# EAGLE design rk8-05 (EAGLE 6.6.0)
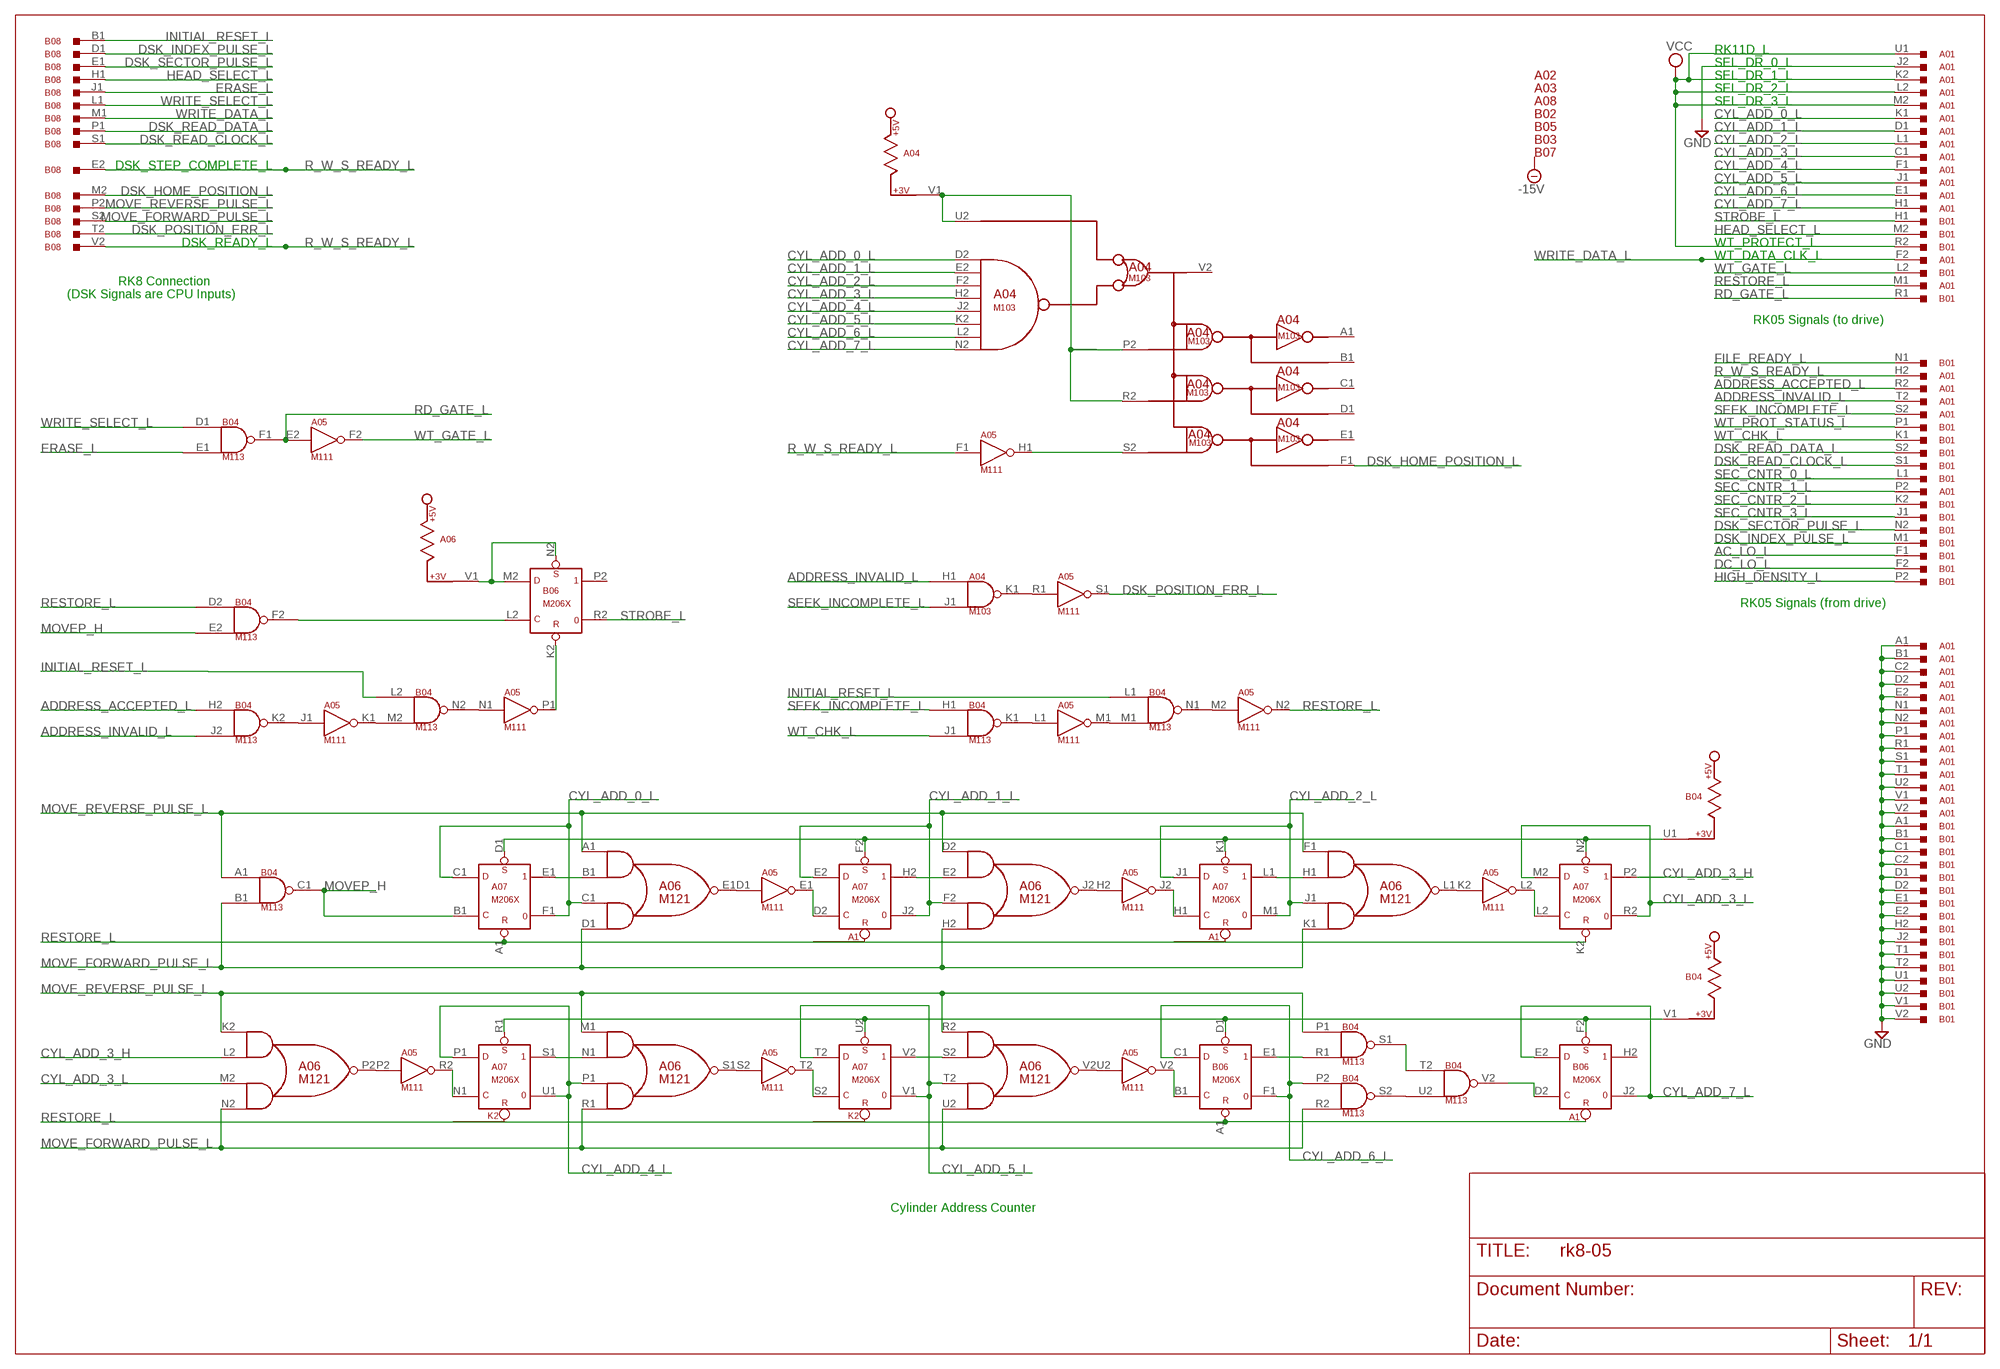
[diagram p0: schematic, sheet 1]

## Parts
A01  M916  [H807]
A02  EMPTY  [H807]
A03  EMPTY  [H807]
A04  M103  [H807]
A05  M111  [H807]
A06  M121  [H807]
A07  M206X  [H807]
A08  EMPTY  [H807]
B01  M916  [H807]
B02  EMPTY  [H807]
B03  EMPTY  [H807]
B04  M113  [H807]
B05  EMPTY  [H807]
B06  M206X  [H807]
B07  EMPTY  [H807]
B08  M903  [H807]

## Nets
AC_LO_L: B01.F1
ADDRESS_ACCEPTED_L: A01.R2 B04.H2(K2:IN1)
ADDRESS_INVALID_L: A01.T2 A04.H1(K1:IN1) B04.J2(K2:IN2)
CYL_ADD_0_L: A01.K1 A04.D2(V2:D2) A06.C1(E1:IN2A) A07.C1(E1:D) A07.F1
CYL_ADD_1_L: A01.D1 A04.E2(V2:E2) A06.F2(J2:IN2A) A07.E2(H2:D) A07.J2
CYL_ADD_2_L: A01.L1 A04.F2(V2:F2) A06.J1(L1:IN2A) A07.J1(L1:D) A07.M1
CYL_ADD_3_H: A06.L2(P2:IN1B) A07.P2
CYL_ADD_3_L: A01.C1 A04.H2(V2:H2) A06.M2(P2:IN2A) A07.M2(P2:D) A07.R2
CYL_ADD_4_L: A01.F1 A04.J2(V2:J2) A06.P1(S1:IN2A) A07.P1(S1:D) A07.U1
CYL_ADD_5_L: A01.J1 A04.K2(V2:K2) A06.T2(V2:IN2A) A07.T2(V2:D) A07.V1
CYL_ADD_6_L: A01.E1 A04.L2(V2:L2) B04.P2(S2:IN1) B06.C1(E1:D) B06.F1
CYL_ADD_7_L: A01.H1 A04.N2(V2:N2) B06.E2(H2:D) B06.J2
DC_LO_L: B01.F2
DSK_HOME_POSITION_L: A04.F1(V2:F1) B08.M2
DSK_INDEX_PULSE_L: B01.M1 B08.D1
DSK_POSITION_ERR_L: A05.S1(S1:OUT) B08.T2
DSK_READ_CLOCK_L: B01.S1 B08.S1
DSK_READ_DATA_L: B01.S2 B08.P1
DSK_SECTOR_PULSE_L: B01.N2 B08.E1
ERASE_L: B04.E1(F1:IN2) B08.J1
FILE_READY_L: B01.N1
GND [power]: A01.A1 A01.B1 A01.C2 A01.D2 A01.E2 A01.J2 A01.N1 A01.N2 A01.P1 A01.R1 A01.S1 A01.T1 A01.U2 A01.V1 A01.V2 B01.A1 B01.B1 B01.C1 B01.C2 B01.D1 B01.D2 B01.E1 B01.E2 B01.H2 B01.J2 B01.T1 B01.T2 B01.U1 B01.U2 B01.V1 B01.V2
HEAD_SELECT_L: B01.M2 B08.H1
HIGH_DENSITY_L: B01.P2
INITIAL_RESET_L: B04.L1(N1:IN1) B04.L2(N2:IN1) B08.B1
MOVE_FORWARD_PULSE_L: A06.D1(E1:IN2B) A06.H2(J2:IN2B) A06.K1(L1:IN2B) A06.N2(P2:IN2B) A06.R1(S1:IN2B) A06.U2(V2:IN2B) B04.B1(C1:IN2) B04.R2(S2:IN2) B08.S2
MOVE_REVERSE_PULSE_L: A06.A1(E1:IN1A) A06.D2(J2:IN1A) A06.F1(L1:IN1A) A06.K2(P2:IN1A) A06.M1(S1:IN1A) A06.R2(V2:IN1A) B04.A1(C1:IN1) B04.P1(S1:IN1) B08.P2
MOVEP_H: A07.B1(E1:C) B04.C1(C1:OUT) B04.E2(F2:IN2)
N$1: A05.P2(R2:IN) A06.P2(P2:OUT)
N$2: A07.D1(E1:S) A07.F2(H2:S) A07.K1(L1:S) A07.N2(P2:S) B04.U1
N$3: A07.R1(S1:S) A07.U2(V2:S) B04.V1 B06.D1(E1:S) B06.F2(H2:S)
N$4: A06.B1(E1:IN1B) A07.E1
N$5: A05.E1(E1:OUT) A07.D2(H2:C)
N$6: A06.E2(J2:IN1B) A07.H2
N$7: A05.J2(J2:OUT) A07.H1(L1:C)
N$8: A05.R2(R2:OUT) A07.N1(S1:C)
N$9: A06.H1(L1:IN1B) A07.L1
N$10: A05.S2(T2:IN) A06.S1(S1:OUT)
N$11: A05.L2(L2:OUT) A07.L2(P2:C)
N$12: A05.T2(T2:OUT) A07.S2(V2:C)
N$13: B04.S2(S2:OUT) B04.U2(V2:IN2)
N$14: B04.S1(S1:OUT) B04.T2(V2:IN1)
N$15: A05.H2(J2:IN) A06.J2(J2:OUT)
N$16: A04.S2(V2:S2) A05.H1(H1:OUT)
N$17: A05.D1(E1:IN) A06.E1(E1:OUT)
N$18: A05.U2(V2:IN) A06.V2(V2:OUT)
N$19: B04.V2(V2:OUT) B06.D2(H2:C)
N$20: B04.R1(S1:IN2) B06.E1
N$21: A05.K2(L2:IN) A06.L1(L1:OUT)
N$22: A06.S2(V2:IN1B) A07.V2
N$23: A06.N1(S1:IN1B) A07.S1
N$24: B04.F2(F2:OUT) B06.L2(P2:C)
N$25: A05.L1(M1:IN) B04.K1(K1:OUT)
N$26: A05.M1(M1:OUT) B04.M1(N1:IN2)
N$27: A06.V1 B06.M2(P2:D) B06.N2(P2:S)
N$28: A04.K1(K1:OUT) A05.R1(S1:IN)
N$29: A05.V2(V2:OUT) B06.B1(E1:C)
N$30: A05.J1(K1:IN) B04.K2(K2:OUT)
N$31: A05.K1(K1:OUT) B04.M2(N2:IN2)
N$32: A05.N1(P1:IN) B04.N2(N2:OUT)
N$33: A05.P1(P1:OUT) B06.K2(P2:R)
N$34: A05.M2(N2:IN) B04.N1(N1:OUT)
N$36: A04.P2(V2:P2) A04.R2(V2:R2) A04.U2(V2:U2) A04.V1
R_W_S_READY_L: A01.H2 A05.F1(H1:IN) B08.E2 B08.V2
RD_GATE_L: A05.E2(F2:IN) B01.R1 B04.F1(F1:OUT)
RESTORE_L: A01.M1 A05.N2(N2:OUT) A07.A1(E1:R) A07.K2(P2:R) B04.D2(F2:IN1) B06.A1(E1:R)
SEC_CNTR_0_L: B01.L1
SEC_CNTR_1_L: A01.P2
SEC_CNTR_2_L: B01.K2
SEC_CNTR_3_L: B01.J1
SEEK_INCOMPLETE_L: A01.S2 A04.J1(K1:IN2) B04.H1(K1:IN1)
STROBE_L: B01.H1 B06.R2
VCC: A01.K2 A01.L2 A01.M2 A01.U1 B01.R2
WRITE_DATA_L: A01.F2 B08.M1
WRITE_SELECT_L: B04.D1(F1:IN1) B08.L1
WT_CHK_L: B01.K1 B04.J1(K1:IN2)
WT_GATE_L: A05.F2(F2:OUT) B01.L2
WT_PROT_STATUS_L: B01.P1
Unconnected: A01.A2 A01.B2 A04.A1(V2:A1) A04.B1(V2:B1) A04.C1(V2:C1) A04.D1(V2:D1) A04.E1(V2:E1) A04.L1(N1:IN1) A04.M1(N1:IN2) A04.N1(N1:OUT) A04.V2(V2:V2) A05.A1(B1:IN) A05.B1(B1:OUT) A05.C1(D2:IN) A05.D2(D2:OUT) A05.U1(U1:OUT) A05.V1(U1:IN) A06.U1 B01.A2 B01.B2 B06.H1(L1:C) B06.H2 B06.J1(L1:D) B06.K1(L1:S) B06.L1 B06.M1 B06.N1(S1:C) B06.P1(S1:D) B06.P2 B06.R1(S1:S) B06.S1 B06.S2(V2:C) B06.T2(V2:D) B06.U1 B06.U2(V2:S) B06.V1 B06.V2 B08.D2 B08.H2 B08.K2

## Notes on the sheet
- RK11D_L
- SEL_DR_0_L
- SEL_DR_1_L
- SEL_DR_2_L
- SEL_DR_3_L
- DSK_STEP_COMPLETE_L
- DSK_READY_L | WT_PROTECT_L
- WT_DATA_CLK_L
- RK8 Connection
- (DSK Signals are CPU Inputs)
- RK05 Signals (to drive)
- RK05 Signals (from drive)
- Cylinder Address Counter

## Power pins joined to a net without a drawn wire
-15V: A02.B2 A03.B2 A08.B2 B02.B2 B03.B2 B05.B2 B07.B2
GND: A02.C2 A03.C2 A04.C2(GND) A04.T1(GND) A05.C2(GND) A05.T1(GND) A06.C2(GND) A06.T1(GND) A07.C2(GND) A07.T1(GND) A08.C2 B02.C2 B03.C2 B04.C2(GND) B04.T1(GND) B05.C2 B06.C2(GND) B06.T1(GND) B07.C2 B08.A1 B08.C1 B08.C2 B08.F1 B08.F2 B08.J2 B08.K1 B08.L2 B08.N1 B08.N2 B08.R1 B08.R2 B08.T1 B08.U2
VCC: A02.A2 A03.A2 A04.A2(VCC) A05.A2(VCC) A06.A2(VCC) A07.A2(VCC) A08.A2 B02.A2 B03.A2 B04.A2(VCC) B05.A2 B06.A2(VCC) B07.A2

## Library data of the parts
A01 B01 = dec-m:M916: Simple 36 pin connector/wire cable
A02 A03 A08 B02 B03 B05 B07 = dec-m:EMPTY: Empty Slot
A04 = dec-m:M103: M103 Device Selector Used to decode IOT requests.
A05 = dec-m:M111: Sixteen inverters.
A06 = dec-m:M121: 6 2-2 AND-NOR Gates
A07 B06 = dec-m:M206X: Two sets of 3 D flip-flops
B04 = dec-m:M113: 10 2-input NAND Gates
B08 = dec-m:M903: Two-sided Posibus cable/connector.

## Net classes
1 power: width 0.508 mm

## Board
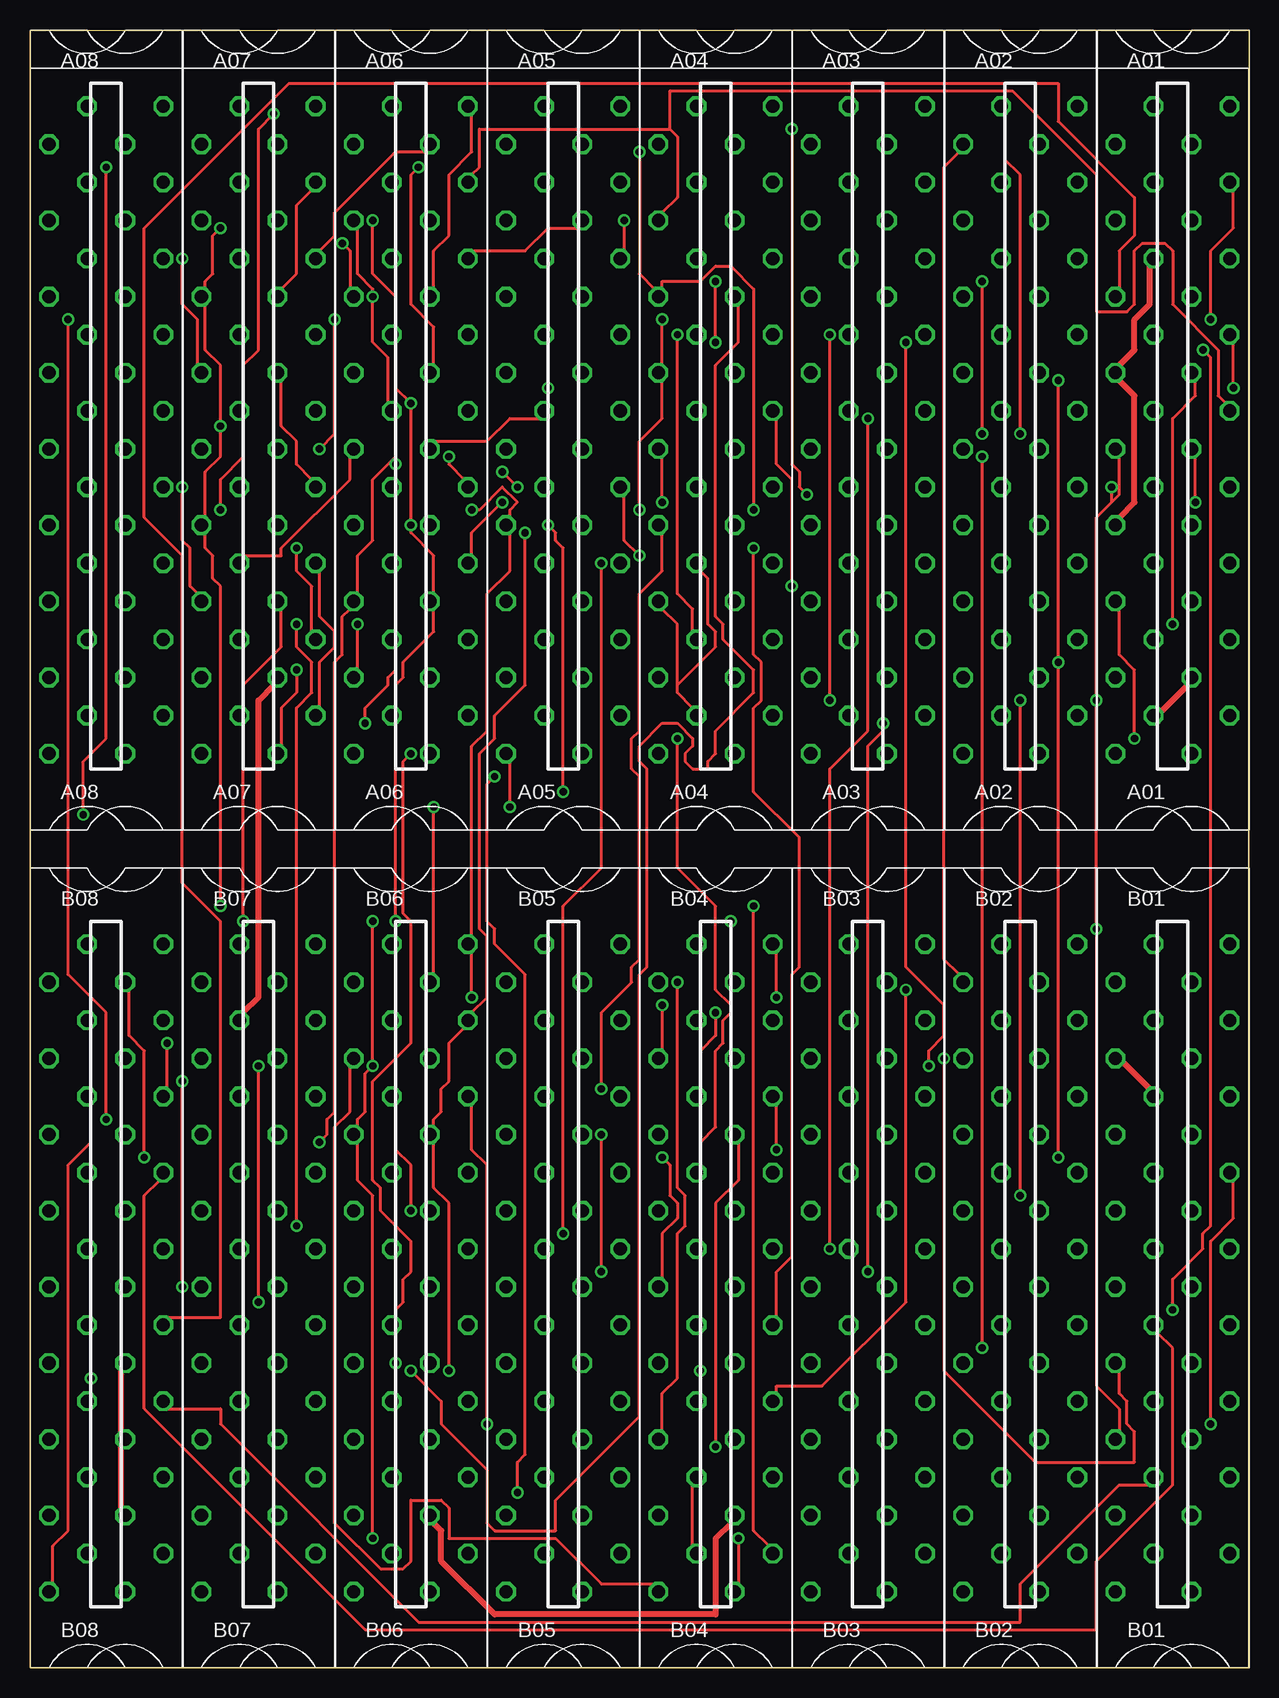
[diagram p1: board, top side]
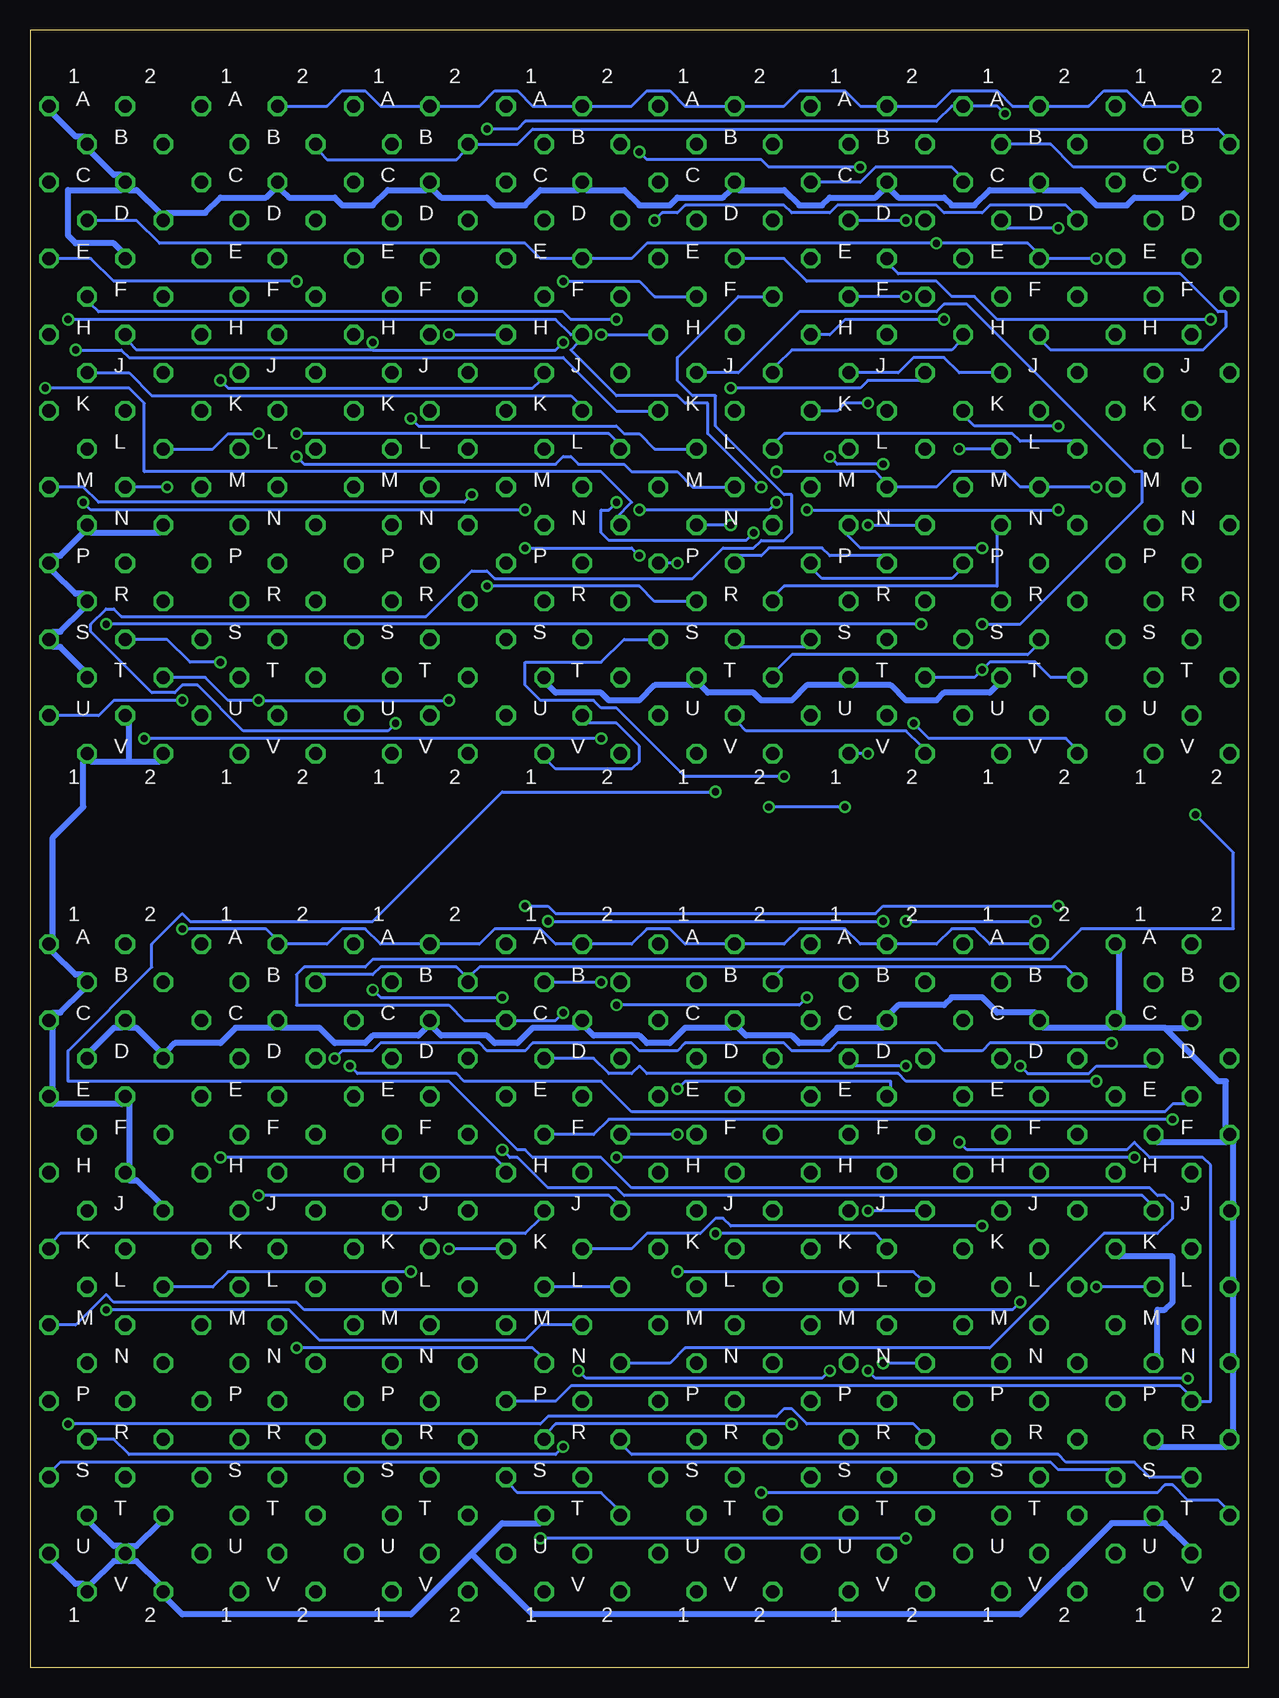
[diagram p2: board, bottom side, seen from below]

Size 101.6 x 136.53 mm. Coordinates in mm from the lower left corner, seen from the top.
Outline: 0,0 101.6,0 101.6,136.53 0,136.53 0,0
Copper layers (1*16): Top 0.035mm / dielectric 1.5mm / Bottom 0.035mm
Design rules "10mils": minimum track width 10mil, minimum drill 24mil, track to track 10mil, track to pad 10mil, pad to pad 10mil, via to via 10mil, smd to smd 10mil, copper to edge 25mil, drill to drill 10mil, minimum pad ring 10mil, minimum via ring 8mil, stop-mask expansion 0mil, vias tented up to drill 0mil, thermal gap 10mil

### Footprints (pad centres in the part's own frame; a part is rotated, then mirrored left to right if it is on the bottom)
H807 = drill 1.092 octagon: A1 4.763,28.575; A2 -1.587,28.575; B1 1.587,25.4; B2 -4.763,25.4; C1 4.763,22.225; C2 -1.587,22.225; D1 1.587,19.05; D2 -4.763,19.05; E1 4.763,15.875; E2 -1.587,15.875; F1 1.587,12.7; F2 -4.763,12.7; H1 4.763,9.525; H2 -1.587,9.525; J1 1.587,6.35; J2 -4.763,6.35; K1 4.763,3.175; K2 -1.587,3.175; L1 1.587,0; L2 -4.763,0; M1 4.763,-3.175; M2 -1.587,-3.175; N1 1.587,-6.35; N2 -4.763,-6.35; P1 4.763,-9.525; P2 -1.587,-9.525; R1 1.587,-12.7; R2 -4.763,-12.7; S1 4.763,-15.875; S2 -1.587,-15.875; T1 1.587,-19.05; T2 -4.763,-19.05; U1 4.763,-22.225; U2 -1.587,-22.225; V1 1.587,-25.4; V2 -4.763,-25.4

### Placement (x,y rotation side)
A01  95.25,101.6 0 top
A02  82.55,101.6 0 top
A03  69.85,101.6 0 top
A04  57.15,101.6 0 top
A05  44.45,101.6 0 top
A06  31.75,101.6 0 top
A07  19.05,101.6 0 top
A08  6.35,101.6 0 top
B01  95.25,31.75 0 top
B02  82.55,31.75 0 top
B03  69.85,31.75 0 top
B04  57.15,31.75 0 top
B05  44.45,31.75 0 top
B06  31.75,31.75 0 top
B07  19.05,31.75 0 top
B08  6.35,31.75 0 top
U$1  [CBLOCK]  0,0 0 top
U$2  [CBLOCK]  50.8,0 0 top

### Tracks (layer width: path | path; a pad name or v marks a point on that pad's centre or on a via)
-15V
  Top 0.254: B02.B2 77.47,57.78 76.2,59.05 76.2,125.09 77.47,126.36 A02.B2
  Bottom 0.254: B02.B2 77.47,57.78 73.03,57.78 72.39,58.42 66.04,58.42 65.41,57.78 B03.B2 64.77,57.78 64.14,58.42 38.73,58.42 | 38.73,58.42 15.24,58.42 14.61,57.78 B07.B2 | 38.73,58.42 39.37,57.78 B05.B2 | A08.B2 1.91,127.64 2.54,128.27 59.69,128.27 60.96,127 64.77,127 A03.B2 65.41,126.36 66.04,125.73 76.83,125.73 77.47,126.36 A02.B2
ADDRESS_ACCEPTED_L  (via drill 0.61)
  Top 0.254: v53.98,77.47 53.98,66.67 57.15,63.5 57.15,56.52 58.42,55.24 58.42,54.61 57.78,53.98 57.78,52.07 57.15,51.44 57.15,45.09 55.88,43.81 55.88,41.91 B04.H2 | v92.08,77.47 92.08,83.19 90.81,84.45 90.81,88.27 A01.R2
  Bottom 0.254: v53.98,77.47 v92.08,77.47
ADDRESS_INVALID_L  (via drill 0.61)
  Top 0.254: v82.55,39.37 v82.55,80.64 | v66.67,80.64 v66.67,111.12
  Bottom 0.254: v82.55,39.37 53.34,39.37 52.7,38.73 B04.J2 | A01.T2 90.17,82.55 87,82.55 85.09,80.64 v82.55,80.64 v66.67,80.64 | v66.67,111.12 62.23,111.12 A04.H1
CYL_ADD_0_L
  Top 0.254: A07.F1 20.95,114.94 22.23,116.2 22.23,121.92 23.5,123.19 A07.C1 | 53.34,128.27 53.98,127.64 53.98,122.56 52.7,121.28 A04.D2 | 53.34,128.27 37.47,128.27 37.47,125.09 36.83,124.46 A06.C1 | 53.34,128.27 53.34,131.44 81.92,131.44 88.9,124.46 88.9,113.03 91.44,113.03 92.08,113.67 92.08,118.11 92.71,118.75 94.61,118.75 95.25,118.11 95.25,113.67 99.06,109.86 99.06,106.05 99.69,105.41 A01.K1
  Bottom 0.254: A06.C1 36.2,123.83 32.38,123.83 31.11,125.09 24.77,125.09 24.13,124.46 A07.C1
CYL_ADD_1_L  (via drill 0.61)
  Top 0.254: v26.04,118.75 26.67,118.11 26.67,114.94 A06.F2 | v12.7,117.47 12.7,113.67 13.97,112.39 13.97,108.58 A07.J2
  Bottom 0.254: v12.7,117.47 17.14,117.47 A07.E2 17.78,118.11 18.41,118.75 v26.04,118.75 50.16,118.75 51.44,117.47 55.24,117.47 A04.E2 55.88,117.47 59.05,117.47 60.33,118.75 90.81,118.75 92.71,120.65 96.52,120.65 A01.D1
CYL_ADD_2_L  (via drill 0.61)
  Top 0.254: A07.M1 23.5,99.06 22.23,100.33 22.23,102.23 20.95,103.5 20.95,107.31 A07.J1 | v50.8,126.36 50.8,116.2 52.07,114.94 A04.F2 52.7,114.94 52.7,115.57 55.88,115.57 57.15,116.84 58.42,116.84 60.33,114.94 v60.33,96.52 | v32.38,125.09 31.75,124.46 31.75,113.67 33.66,111.76 33.66,108.58 A06.J1 | v97.16,97.16 97.16,100.97 A01.L1
  Bottom 0.254: v50.8,126.36 50.16,125.73 40.64,125.73 40.01,125.09 v32.38,125.09 | v97.16,97.16 96.52,96.52 v60.33,96.52 | A07.J1 20.95,107.95 24.13,107.95 25.4,109.22 27.94,109.22 29.21,107.95 33.02,107.95 A06.J1
CYL_ADD_3_H
  Top 0.254: A07.P2 17.78,92.71 20.95,92.71 20.95,93.34 26.67,99.06 26.67,100.97 A06.L2
CYL_ADD_3_L  (via drill 0.61)
  Top 0.254: v12.7,98.42 12.7,93.98 13.34,93.34 13.34,90.17 13.97,89.53 A07.R2 | v98.42,112.39 98.42,118.11 100.33,120.02 100.33,123.19 A01.C1 | v39.37,99.69 v40.64,98.42
  Bottom 0.254: v12.7,98.42 17.14,98.42 A07.M2 17.78,98.42 19.05,98.42 20.32,99.69 24.77,99.69 26.04,98.42 29.84,98.42 A06.M2 30.48,99.06 31.11,99.69 v39.37,99.69 | v98.42,112.39 57.78,112.39 56.52,111.12 55.88,111.12 A04.H2 55.88,110.49 56.52,109.86 52.7,106.05 47.62,106.05 46.99,105.41 45.09,105.41 45.09,102.87 v40.64,98.42
CYL_ADD_4_L  (via drill 0.61)
  Top 0.254: A07.U1 24.13,80.01 24.13,83.82 25.4,85.09 25.4,86.36 24.13,87.63 24.13,91.44 A07.P1 | v52.7,112.39 52.7,108.58 A04.J2 52.7,107.31 52.7,104.14 50.8,102.23 v50.8,96.52 | v39.37,97.16 36.83,94.61 36.83,92.71 A06.P1
  Bottom 0.254: A06.P1 36.2,91.44 35.56,90.81 24.77,90.81 24.13,91.44 A07.P1 | v52.7,112.39 56.52,112.39 57.15,113.03 95.89,113.03 96.52,113.67 A01.F1 | v39.37,97.16 40.01,96.52 v50.8,96.52
CYL_ADD_5_L  (via drill 0.61)
  Top 0.254: v22.23,83.19 22.23,81.28 20.95,80.01 20.95,76.83 A07.V1 | v27.3,87 27.3,83.19 A06.T2 | v95.25,87 95.25,104.14 97.16,106.05 97.16,107.31 A01.J1
  Bottom 0.254: A06.T2 26.67,82.55 22.86,82.55 v22.23,83.19 21.59,83.82 17.78,83.82 16.51,82.55 14.61,82.55 A07.T2 | A04.K2 55.88,105.41 56.52,106.05 91.44,106.05 93.34,107.95 96.52,107.95 A01.J1 | v27.3,87 v95.25,87
CYL_ADD_6_L  (via drill 0.61)
  Top 0.254: v55.88,24.77 55.88,22.86 B04.P2 | v34.92,24.77 34.92,38.73 33.66,40.01 33.66,43.81 B06.F1 33.66,45.09 33.66,45.72 34.29,46.35 34.29,48.26 34.92,48.9 34.92,52.07 36.2,53.34 B06.C1 36.83,54.61 38.1,55.88 38.1,60.96 37.47,61.59 37.47,76.2 38.73,77.47 38.73,79.38 41.27,81.92 v41.27,94.61 | v79.38,102.87 v79.38,115.57 | v52.7,97.16 52.7,100.97 A04.L2
  Bottom 0.254: v55.88,24.77 55.24,24.13 35.56,24.13 v34.92,24.77 | v79.38,102.87 53.34,102.87 52.7,102.23 A04.L2 | v79.38,115.57 94.61,115.57 96.52,117.47 99.69,117.47 A01.E1 | v41.27,94.61 41.91,93.98 53.34,93.98 53.98,94.61 53.98,96.52 53.34,96.52 v52.7,97.16
CYL_ADD_7_L  (via drill 0.61)
  Top 0.254: v31.75,38.1 31.75,41.91 30.48,43.18 30.48,46.99 B06.E2 | v47.62,48.26 47.62,54.61 50.16,57.15 50.16,58.42 50.8,59.05 50.8,74.3 50.16,74.93 50.16,77.47 50.8,78.11 50.8,89.53 52.7,91.44 52.7,94.61 A04.N2 | v100.33,106.68 100.33,110.49 A01.H1
  Bottom 0.254: v31.75,38.1 27.3,38.1 B06.J2 | v47.62,48.26 46.99,48.9 29.84,48.9 29.84,48.26 B06.E2 | v100.33,106.68 93.34,106.68 92.08,105.41 92.08,99.69 53.98,99.69 51.44,97.16 52.7,95.89 A04.N2
DSK_HOME_POSITION_L  (via drill 0.61)
  Top 0.254: v5.08,24.13 5.08,27.94 B08.M2 | v31.75,24.77 34.29,22.23 34.29,20.32 38.1,16.51 38.1,12.06 38.73,11.43 43.81,11.43 43.81,13.97 50.8,20.95 50.8,57.78 51.44,58.42 51.44,74.93 50.8,75.56 50.8,76.83 52.7,78.74 53.98,78.74 55.24,77.47 55.24,76.83 54.61,76.2 54.61,75.56 55.24,74.93 56.52,74.93 56.52,75.56 57.15,76.2 57.15,78.11 60.33,81.28 60.33,83.19 57.78,85.72 57.78,87 57.15,87.63 57.15,108.58 59.05,110.49 59.05,113.67 A04.F1
  Bottom 0.254: v5.08,24.13 31.11,24.13 v31.75,24.77
DSK_INDEX_PULSE_L  (via drill 0.61)
  Top 0.254: v19.05,30.48 v19.05,50.16
  Bottom 0.254: v19.05,50.16 18.41,49.53 13.34,49.53 12.7,50.16 8.26,50.16 B08.D1 | v19.05,30.48 19.68,29.84 78.74,29.84 79.38,30.48 94.61,30.48 95.25,31.11 97.79,28.57 99.69,28.57 B01.M1
DSK_POSITION_ERR_L  (via drill 0.61)
  Top 0.254: v40.64,14.61 40.64,17.14 41.27,17.78 41.27,57.78 38.73,60.33 38.73,61.59 38.1,62.23 38.1,73.66 v38.73,74.3
  Bottom 0.254: v40.64,14.61 7.62,14.61 6.99,15.24 6.35,15.24 5.08,13.97 2.54,13.97 1.91,13.34 B08.T2 | v38.73,74.3 46.99,74.3 52.7,80.01 53.98,80.01 54.61,80.64 59.05,80.64 60.33,81.92 60.33,83.82 53.98,83.82 52.07,85.72 49.53,85.72 A05.S1
DSK_READ_CLOCK_L
  Bottom 0.254: B08.S1 11.43,16.51 15.88,16.51 16.51,17.14 99.06,17.14 99.69,16.51 B01.S1
DSK_READ_DATA_L
  Top 0.254: B08.P1 11.43,21.59 15.88,21.59 15.88,20.32 32.38,3.81 82.55,3.81 82.55,6.99 90.81,15.24 93.34,15.24 B01.S2
DSK_SECTOR_PULSE_L  (via drill 0.61)
  Top 0.254: v11.43,52.07 11.43,48.26 B08.E1 | v76.2,50.8 76.2,24.77 83.82,17.14 92.08,17.14 92.08,19.68 91.44,20.32 91.44,22.23 90.81,22.86 90.81,24.77 B01.N2
  Bottom 0.254: v11.43,52.07 21.59,52.07 22.23,51.44 25.4,51.44 26.04,52.07 34.29,52.07 34.92,51.44 38.1,51.44 38.73,52.07 46.99,52.07 47.62,51.44 50.8,51.44 51.44,52.07 59.69,52.07 60.33,51.44 63.5,51.44 64.14,52.07 72.39,52.07 73.03,51.44 75.56,51.44 v76.2,50.8
ERASE_L  (via drill 0.61)
  Top 0.254: v62.23,43.18 62.23,46.99 B04.E1
  Bottom 0.254: v62.23,43.18 61.59,42.55 60.96,42.55 58.42,40.01 52.7,40.01 52.07,39.37 8.89,39.37 8.26,38.73 B08.J1
GND
  Top 0.508: A01.E2 93.34,116.84 93.34,113.67 92.08,112.39 92.08,109.86 90.81,108.58 A01.J2 90.81,107.31 92.08,106.05 92.08,97.16 90.81,95.89 A01.N2 | B06.T1 33.66,12.06 34.29,11.43 34.29,8.89 38.73,4.45 57.15,4.45 57.15,10.79 58.42,12.06 B04.T1 | A01.T1 96.52,81.92 93.98,79.38 A01.U2 | B08.T1 7.62,13.34 7.62,18.41 B08.R1 7.62,19.68 7.62,24.77 B08.N1 | A07.T1 20.32,81.92 19.05,80.64 19.05,55.88 17.78,54.61 B07.C2 | B01.E2 93.34,48.26 90.81,50.8 B01.D2
  Bottom 0.508: A01.C2 93.34,123.19 92.71,123.19 90.81,121.28 A01.D2 90.17,121.28 87,121.28 85.72,122.56 81.92,122.56 81.28,123.19 A02.C2 80.64,123.19 80.01,122.56 76.2,122.56 75.56,121.92 73.03,121.92 71.75,123.19 68.58,123.19 A03.C2 67.94,123.19 67.31,122.56 63.5,122.56 62.87,121.92 60.33,121.92 59.05,123.19 55.88,123.19 A04.C2 55.24,123.19 52.07,123.19 50.8,121.92 48.26,121.92 47.62,122.56 43.81,122.56 43.18,123.19 A05.C2 42.55,123.19 38.73,123.19 37.47,121.92 35.56,121.92 34.92,122.56 31.11,122.56 30.48,123.19 A06.C2 29.84,123.19 29.21,122.56 25.4,122.56 24.77,121.92 22.86,121.92 21.59,123.19 17.78,123.19 A07.C2 17.14,123.19 13.97,123.19 12.7,121.92 10.16,121.92 9.53,122.56 5.71,122.56 5.08,123.19 A08.C2 | A01.C2 93.98,124.46 94.61,124.46 96.52,126.36 A01.B1 97.16,127.64 97.79,127.64 99.69,129.54 A01.A1 | A01.E2 93.98,118.11 94.61,118.75 97.79,118.75 98.42,119.38 98.42,123.19 93.98,123.19 A01.C2 | B01.U2 93.34,8.89 92.71,8.89 90.81,6.99 B01.V2 90.17,5.71 88.9,4.45 69.85,4.45 64.77,9.53 | B01.T2 90.81,12.06 92.71,10.16 93.34,10.16 B01.U2 | B01.U2 93.98,8.89 94.61,8.89 96.52,6.99 B01.V1 97.16,6.99 97.79,6.99 99.69,8.89 B01.U1 | B01.T1 96.52,12.06 94.61,10.16 93.98,10.16 B01.U2 | 64.77,9.53 62.23,12.06 59.05,12.06 B04.T1 | A01.N2 90.81,94.61 96.52,94.61 A01.N1 97.16,94.61 99.06,92.71 99.69,92.71 A01.P1 99.69,91.44 97.79,89.53 97.16,89.53 A01.R1 97.16,88.27 99.06,86.36 99.69,86.36 A01.S1 99.69,85.09 99.06,85.09 97.16,83.19 A01.T1 | B01.J2 90.81,38.73 92.71,40.64 93.34,40.64 B01.H2 93.34,41.91 93.34,46.99 B01.E2 93.98,46.99 99.69,46.99 B01.E1 99.69,48.26 99.69,53.34 B01.C1 99.69,54.61 99.06,54.61 97.16,56.52 B01.B1 97.16,57.78 97.79,57.78 99.69,59.69 B01.A1 99.69,60.96 99.69,69.22 97.16,71.75 97.16,75.56 A01.V1 96.52,75.56 93.34,75.56
  Bottom 0.508: 93.34,75.56 90.81,75.56 A01.V2 | 93.34,75.56 93.34,78.74 A01.U2 | B08.N1 7.62,26.04 7.62,29.84 6.99,29.84 6.35,30.48 6.35,34.29 10.79,34.29 B08.K1 | B08.U2 5.08,10.16 6.99,12.06 7.62,12.06 B08.T1 8.26,12.06 11.43,12.06 19.05,4.45 59.69,4.45 64.77,9.53 | B08.F2 1.27,43.81 1.27,38.73 B08.J2 1.27,37.47 1.27,32.38 B08.L2 1.27,31.11 1.27,26.04 B08.N2 1.27,24.77 1.27,19.68 B08.R2 1.91,18.41 7.62,18.41 B08.R1 | B08.F1 7.62,43.81 1.91,43.81 B08.F2 | A07.T1 20.95,81.92 21.59,81.28 25.4,81.28 26.04,80.64 28.57,80.64 29.84,81.92 33.02,81.92 A06.T1 33.66,81.92 36.83,81.92 38.1,80.64 40.64,80.64 41.27,81.28 45.09,81.28 45.72,81.92 A05.T1 46.35,81.92 49.53,81.92 50.8,80.64 53.34,80.64 53.98,81.28 57.78,81.28 58.42,81.92 A04.T1 | B01.D1 96.52,51.44 94.61,53.34 93.98,53.34 B01.C2 93.34,53.34 92.71,53.34 90.81,51.44 B01.D2 90.17,51.44 89.53,52.07 85.72,52.07 84.45,53.34 81.28,53.34 B02.C2 80.64,53.34 77.47,53.34 76.2,52.07 73.66,52.07 73.03,52.7 69.22,52.7 68.58,53.34 B03.C2 67.94,53.34 67.31,52.7 63.5,52.7 62.87,52.07 60.96,52.07 59.69,53.34 55.88,53.34 B04.C2 55.24,53.34 54.61,52.7 50.8,52.7 50.16,52.07 48.26,52.07 46.99,53.34 43.18,53.34 B05.C2 42.55,53.34 41.91,52.7 38.1,52.7 37.47,52.07 35.56,52.07 34.29,53.34 30.48,53.34 B06.C2 29.84,54.61 29.21,55.24 25.4,55.24 24.77,55.88 22.23,55.88 20.95,54.61 17.78,54.61 B07.C2 17.14,53.34 11.43,53.34 B08.C1 | 6.99,53.34 10.79,53.34 B08.C1 | 6.99,53.34 5.08,53.34 B08.C2 | B08.A1 10.79,59.69 10.79,54.61 B08.C1 | 6.99,53.34 2.54,48.9 1.91,48.9 1.91,45.09 B08.F2
HEAD_SELECT_L
  Top 0.254: B08.H1 10.79,40.64 9.53,39.37 9.53,21.59 27.94,3.17 88.9,3.17 88.9,8.89 95.25,15.24 95.25,26.67 93.98,27.94 B01.M2
INITIAL_RESET_L  (via drill 0.61)
  Top 0.254: v9.53,42.55 9.53,51.44 8.26,52.7 8.26,56.52 B08.B1 | v52.7,42.55 53.34,41.91 53.34,39.37 53.98,38.73 53.98,37.47 52.7,36.2 52.7,32.38 B04.L2
  Bottom 0.254: B04.L2 52.7,31.75 58.42,31.75 B04.L1 | v9.53,42.55 v52.7,42.55
MOVE_FORWARD_PULSE_L  (via drill 0.61)
  Top 0.254: v28.57,120.65 28.57,116.2 30.48,114.3 30.48,111.76 A06.H2 30.48,110.49 30.48,106.68 v31.75,105.41 v31.75,95.25 31.75,94.61 33.66,92.71 33.66,89.53 A06.R1 33.66,88.27 33.66,86.36 31.11,83.82 31.11,82.55 30.48,81.92 30.48,80.01 A06.U2 30.48,78.74 v30.48,62.23 | v58.42,62.23 58.42,57.78 B04.B1 | v53.98,57.15 53.98,40.01 54.61,39.37 54.61,36.83 53.98,36.2 53.98,24.13 52.7,22.86 52.7,19.68 B04.R2
  Bottom 0.254: B08.S2 5.08,15.88 8.26,15.88 9.53,17.14 15.24,17.14 15.88,17.78 51.44,17.78 52.07,18.41 B04.R2 | v31.75,105.41 33.66,105.41 34.29,104.78 36.2,104.78 A06.K1 | v28.57,120.65 33.02,120.65 A06.D1 | v31.75,95.25 27.3,95.25 A06.N2 | v58.42,62.23 v30.48,62.23 | v53.98,57.15 58.42,57.15 B04.B1
MOVE_REVERSE_PULSE_L  (via drill 0.61)
  Top 0.254: 30.48,100.97 28.57,99.06 28.57,93.98 27.3,92.71 27.3,89.53 A06.R2 26.67,88.27 26.04,87.63 26.04,84.45 25.4,83.82 25.4,46.35 24.77,45.72 24.77,44.45 v24.13,43.81 | 30.48,100.97 30.48,104.14 A06.K2 29.84,105.41 29.84,109.22 28.57,110.49 v28.57,114.3 28.57,114.94 27.3,116.2 27.3,120.02 A06.D2 | v34.92,100.97 34.92,100.33 36.2,99.06 A06.M1 | 30.48,100.97 v30.48,100.33 | A06.A1 36.83,129.54 36.83,126.36 34.92,124.46 34.92,119.38 33.66,118.11 33.66,114.94 A06.F1 | v62.23,55.88 62.23,59.69 B04.A1 | v73.03,56.52 73.03,30.48 66.04,23.5 62.23,23.5 62.23,22.86 B04.P1
  Bottom 0.254: v34.92,100.97 34.29,100.33 v30.48,100.33 | v28.57,114.3 33.02,114.3 A06.F1 | B04.P1 61.59,22.23 57.78,22.23 56.52,23.5 5.71,23.5 5.08,22.86 B08.P2 4.45,22.23 3.17,22.23 3.17,41.91 3.81,42.55 8.26,42.55 9.53,43.81 10.16,43.18 23.5,43.18 v24.13,43.81 | v62.23,55.88 72.39,55.88 v73.03,56.52
MOVEP_H  (via drill 0.61)
  Top 0.254: v57.15,54.61 57.15,52.7 55.88,51.44 55.88,48.26 B04.E2 | v6.35,125.09 6.35,77.47 4.45,75.56 v4.45,71.12
  Bottom 0.254: v57.15,54.61 57.78,53.98 61.59,53.98 B04.C1 62.23,53.98 65.41,53.98 66.67,55.24 79.38,55.24 79.38,57.78 78.74,58.42 73.66,58.42 73.03,59.05 16.51,59.05 13.97,61.59 1.27,61.59 1.27,67.94 v4.45,71.12 | v6.35,125.09 14.61,125.09 16.51,127 20.32,127 A07.B1
N$1
  Bottom 0.254: A06.P2 30.48,92.71 34.92,92.71 35.56,93.34 40.01,93.34 40.64,92.71 42.55,92.71 A05.P2
N$2  (via drill 0.61)
  Top 0.254: v60.33,63.5 60.33,11.43 61.59,10.16 B04.U1 | v15.88,63.5 15.88,90.17 15.24,90.81 15.24,92.71 14.61,93.34 14.61,94.61 A07.N2 14.61,95.89 14.61,99.69 15.88,100.97 v15.88,103.5 15.88,108.58 14.61,109.86 14.61,113.67 A07.F2 14.61,114.94 14.61,115.57 15.24,116.2 15.24,119.38 v15.88,120.02
  Bottom 0.254: v60.33,63.5 58.42,63.5 57.78,62.87 31.11,62.87 30.48,63.5 v15.88,63.5 | v15.88,103.5 22.86,103.5 23.5,104.14 A07.K1 | v15.88,120.02 20.32,120.02 A07.D1
N$3  (via drill 0.61)
  Top 0.254: A07.R1 20.95,88.27 20.95,85.09 17.78,81.92 17.78,80.01 A07.U2 17.78,78.74 v17.78,62.23 | v59.05,10.79 59.05,6.99 B04.V1 | v28.57,10.79 28.57,39.37 27.3,40.64 27.3,42.55 27.3,43.81 B06.F2 27.3,45.09 27.3,45.72 27.94,46.35 27.94,49.53 v28.57,50.16 v28.57,62.23
  Bottom 0.254: v28.57,10.79 v59.05,10.79 | v28.57,50.16 33.02,50.16 B06.D1 | v28.57,62.23 v17.78,62.23
N$4
  Top 0.254: A07.E1 24.13,118.11 25.4,119.38 25.4,121.28 30.48,126.36 33.02,126.36 A06.B1
N$5  (via drill 0.61)
  Top 0.254: v49.53,120.65 49.53,118.11 A05.E1
  Bottom 0.254: v49.53,120.65 48.9,121.28 47.62,121.28 46.99,121.92 38.73,121.92 38.1,121.28 34.92,121.28 34.29,121.92 26.04,121.92 25.4,121.28 22.23,121.28 21.59,121.92 15.24,121.92 14.61,121.28 A07.D2
N$6
  Bottom 0.254: A07.H2 17.14,110.49 16.51,109.86 3.81,109.86 1.91,111.76 1.91,113.03 2.54,113.03 5.71,116.2 29.21,116.2 29.84,116.84 A06.E2
N$7
  Bottom 0.254: A07.H1 24.13,110.49 24.77,109.86 38.1,109.86 39.37,108.58 A05.J2
N$8
  Bottom 0.254: A07.N1 20.95,94.61 20.95,90.17 38.73,90.17 39.37,89.53 A05.R2
N$9  (via drill 0.61)
  Top 0.254: v24.13,101.6 25.4,102.87 v25.4,112.39
  Bottom 0.254: v24.13,101.6 20.95,101.6 A07.L1 | v25.4,112.39 33.66,112.39 34.92,111.12 36.2,111.12 A06.H1
N$10
  Bottom 0.254: A06.S1 36.83,85.09 42.55,85.09 A05.S2
N$11
  Bottom 0.254: A07.L2 14.61,102.23 19.05,102.23 19.68,102.87 38.73,102.87 39.37,102.23 A05.L2
N$12
  Bottom 0.254: A07.S2 17.78,85.09 18.41,84.45 38.1,84.45 39.37,83.19 A05.T2
N$13
  Top 0.254: B04.U2 55.24,10.16 55.24,15.24 B04.S2
N$14
  Bottom 0.254: B04.T2 52.7,13.34 53.98,14.61 60.96,14.61 61.59,15.24 B04.S1
N$15  (via drill 0.61)
  Top 0.254: v43.18,106.68 43.18,110.49 A05.H2
  Bottom 0.254: v43.18,106.68 32.38,106.68 31.75,107.31 27.3,107.31 A06.J2
N$16  (via drill 0.61)
  Top 0.254: v53.98,111.12 53.98,89.53 55.24,88.27 55.24,86.36 A04.S2
  Bottom 0.254: v53.98,111.12 49.53,111.12 A05.H1
N$17
  Top 0.254: A06.E1 36.83,118.11 41.27,118.11 43.18,120.02 45.72,120.02 A05.D1
N$18
  Bottom 0.254: A06.V2 27.3,76.83 28.57,78.11 41.91,78.11 42.55,78.74 A05.U2
N$19
  Top 0.254: B04.V2 52.07,6.99 47.62,6.99 43.81,10.79 34.92,10.79 34.92,13.34 34.29,13.97 31.75,13.97 31.75,8.89 31.11,8.26 29.21,8.26 25.4,12.06 25.4,45.09 26.67,46.35 26.67,50.16 B06.D2
N$20  (via drill 0.61)
  Top 0.254: v38.1,20.32 38.1,41.91 36.83,43.18 36.83,46.99 B06.E1
  Bottom 0.254: v38.1,20.32 57.78,20.32 58.42,19.68 B04.R1
N$21
  Top 0.254: A06.L1 33.66,102.23 38.1,102.23 40.01,104.14 42.55,104.14 A05.K2
N$22  (via drill 0.61)
  Top 0.254: v27.94,78.74 27.94,80.01 29.84,81.92 29.84,82.55 30.48,83.19 30.48,85.09 A06.S2
  Bottom 0.254: v27.94,78.74 26.67,77.47 15.24,77.47 14.61,76.83 A07.V2
N$23  (via drill 0.61)
  Top 0.254: v22.23,93.34 22.23,91.44 23.5,90.17 23.5,86.36 A07.S1
  Bottom 0.254: v22.23,93.34 32.38,93.34 33.66,94.61 A06.N1
N$24  (via drill 0.61)
  Top 0.254: v47.62,33.02 v47.62,44.45
  Bottom 0.254: v47.62,33.02 27.94,33.02 27.3,32.38 B06.L2 | v47.62,44.45 52.07,44.45 B04.F2
N$25  (via drill 0.61)
  Top 0.254: v66.67,34.92 66.67,74.93 69.85,78.11 v69.85,104.14
  Bottom 0.254: v66.67,34.92 62.23,34.92 B04.K1 | v69.85,104.14 69.22,103.5 52.7,103.5 52.07,102.87 50.8,102.87 49.53,101.6 46.35,101.6 A05.L1
N$26  (via drill 0.61)
  Top 0.254: v50.8,92.71 49.53,93.98 49.53,97.79 A05.M1 | v60.33,93.34 60.33,84.45 60.96,83.82 60.96,80.64 60.33,80.01 60.33,73.03 64.14,69.22 64.14,58.42 63.5,57.78 63.5,34.29 62.23,33.02 62.23,29.21 B04.M1
  Bottom 0.254: v50.8,92.71 51.44,93.34 v60.33,93.34
N$27  (via drill 0.61)
  Top 0.254: v30.48,25.4 30.48,27.94 B06.M2 30.48,29.21 30.48,29.84 31.11,30.48 31.11,32.38 31.75,33.02 31.75,35.56 29.21,38.1 29.21,40.01 28.57,40.64 28.57,48.9 31.75,52.07 31.75,62.23 31.11,62.87 31.11,75.56 v31.75,76.2
  Bottom 0.254: v30.48,25.4 27.3,25.4 B06.N2 | v31.75,76.2 33.02,76.2 A06.V1
N$28  (via drill 0.61)
  Top 0.254: v63.5,90.17 63.5,99.06 62.23,100.33 62.23,104.14 A04.K1
  Bottom 0.254: v63.5,90.17 50.8,90.17 49.53,88.9 46.35,88.9 A05.R1
N$29  (via drill 0.61)
  Top 0.254: v33.66,71.75 33.66,57.78 B06.B1 | v40.01,71.75 40.01,75.56 A05.V2
  Bottom 0.254: v33.66,71.75 v40.01,71.75
N$30  (via drill 0.61)
  Top 0.254: v22.23,36.83 22.23,80.01 23.5,81.28 23.5,83.82 22.23,85.09 v22.23,87
  Bottom 0.254: v22.23,36.83 43.18,36.83 43.81,37.47 44.45,37.47 45.72,36.2 50.16,36.2 51.44,34.92 55.24,34.92 B04.K2 | v22.23,87 19.05,87 8.89,97.16 8.89,99.69 9.53,99.69 23.5,113.67 25.4,113.67 26.04,113.03 37.47,113.03 42.55,107.95 45.72,107.95 A05.J1
N$31  (via drill 0.61)
  Top 0.254: v95.25,29.84 95.25,32.38 97.79,34.92 97.79,36.2 98.42,36.83 98.42,109.22 v97.79,109.86
  Bottom 0.254: v95.25,29.84 80.01,29.84 77.47,27.3 60.33,27.3 59.05,28.57 55.88,28.57 B04.M2 | v97.79,109.86 93.98,109.86 93.34,109.22 57.15,109.22 52.7,104.78 49.53,104.78 A05.K1
N$32  (via drill 0.61)
  Top 0.254: v43.18,95.25 43.81,94.61 43.81,93.98 44.45,93.34 v44.45,73.03
  Bottom 0.254: v43.18,95.25 45.72,95.25 A05.N1 | v44.45,73.03 62.23,73.03 73.03,62.23 88.27,62.23 88.9,62.87 91.44,60.33 91.44,58.42 98.42,51.44 98.42,48.9 66.67,48.9 60.96,43.18 60.33,43.18 59.69,42.55 53.98,42.55 51.44,40.01 8.26,40.01 7.62,39.37 6.99,39.37 6.35,38.73 6.35,37.47 7.62,36.2 12.06,36.2 21.59,26.67 46.99,26.67 48.26,25.4 52.07,25.4 B04.N2
N$33  (via drill 0.61)
  Top 0.254: v44.45,36.2 44.45,63.5 47.62,66.67 v47.62,92.08
  Bottom 0.254: v44.45,36.2 31.11,36.2 30.48,35.56 B06.K2 | v47.62,92.08 48.9,92.08 A05.P1
N$34  (via drill 0.61)
  Top 0.254: v79.38,26.67 v79.38,100.97
  Bottom 0.254: v79.38,26.67 59.69,26.67 59.05,26.04 B04.N1 | v79.38,100.97 78.74,100.33 57.78,100.33 57.15,100.97 56.52,100.97 55.88,100.33 52.07,100.33 51.44,99.69 47.62,99.69 46.35,98.42 43.18,98.42 A05.M2
N$36
  Top 0.254: 53.98,81.92 53.98,81.28 55.24,80.01 A04.U2 | 53.98,81.92 53.98,87 52.7,88.27 A04.R2 | 53.98,81.92 57.15,85.09 57.15,86.36 56.52,87 56.52,90.81 55.88,91.44 A04.P2
  Bottom 0.254: A04.V1 58.42,75.56 57.78,74.93 51.44,74.93 50.8,75.56 50.8,76.83 52.7,78.74 55.24,78.74 A04.U2
R_W_S_READY_L  (via drill 0.61)
  Top 0.254: B08.V2 1.91,6.99 1.91,10.16 3.17,11.43 3.17,41.91 5.08,43.81 5.08,46.99 B08.E2 | v57.15,110.49 v57.15,115.57 | v74.93,50.16 74.93,51.44 76.2,52.7 76.2,55.24 73.03,58.42 v73.03,110.49
  Bottom 0.254: 73.03,109.86 57.78,109.86 v57.15,110.49 | 73.03,109.86 92.71,109.86 93.34,110.49 A01.H2 | v57.15,115.57 50.8,115.57 49.53,114.3 46.35,114.3 A05.F1 | v74.93,50.16 74.3,49.53 66.04,49.53 65.41,48.9 53.98,48.9 51.44,46.35 6.99,46.35 6.35,46.99 5.08,46.99 B08.E2 | v73.03,110.49 73.03,109.86
RD_GATE_L  (via drill 0.61)
  Top 0.254: v57.15,18.41 57.15,38.73 59.05,40.64 59.05,43.81 B04.F1 | v3.17,112.39 3.17,57.78 6.35,54.61 v6.35,45.72
  Bottom 0.254: v57.15,18.41 57.78,17.78 93.34,17.78 94.61,19.05 96.52,19.05 B01.R1 | v3.17,112.39 20.95,112.39 22.86,114.3 24.77,114.3 26.04,115.57 36.83,115.57 38.73,117.47 42.55,117.47 A05.E2 | v6.35,45.72 53.34,45.72 54.61,44.45 58.42,44.45 B04.F1
RESTORE_L  (via drill 0.61)
  Top 0.254: v52.7,55.24 52.7,51.44 B04.D2 | v36.83,55.88 36.83,59.69 B06.A1 36.83,60.96 36.83,76.83 38.1,78.11 38.1,89.53 40.01,91.44 40.01,94.61 A05.N2 40.01,95.89 40.01,96.52 40.64,97.16 39.37,98.42 37.47,96.52 v36.83,96.52 | v20.32,129.54 19.05,128.27 19.05,109.86 17.78,108.58 17.78,105.41 A07.K2 17.78,104.14 17.78,100.97 15.88,99.06 v15.88,96.52 | v64.77,97.79 64.14,98.42 64.14,99.69 63.5,100.33 v63.5,128.27
  Bottom 0.254: v52.7,55.24 37.47,55.24 v36.83,55.88 | v20.32,129.54 20.95,130.18 23.5,130.18 A07.A1 24.13,130.18 24.77,130.18 26.04,128.91 60.33,128.91 60.96,128.27 v63.5,128.27 | v64.77,97.79 65.41,97.16 95.89,97.16 97.16,98.42 99.69,98.42 A01.M1 | v36.83,96.52 v15.88,96.52
SEEK_INCOMPLETE_L  (via drill 0.61)
  Top 0.254: v85.72,42.55 v85.72,83.82 v85.72,107.31
  Bottom 0.254: v85.72,42.55 62.87,42.55 62.23,41.91 B04.H1 | v85.72,83.82 88.27,83.82 90.17,85.72 93.34,85.72 A01.S2 | v85.72,107.31 85.09,106.68 59.69,106.68 59.05,107.31 A04.J1
STROBE_L  (via drill 0.61)
  Top 0.254: v98.42,20.32 98.42,35.56 100.33,37.47 100.33,40.64 B01.H1
  Bottom 0.254: v98.42,20.32 59.05,20.32 58.42,20.95 39.37,20.95 38.73,21.59 38.1,21.59 36.83,20.32 27.94,20.32 27.3,19.68 B06.R2
VCC  (via drill 0.61)
  Top 0.254: A01.K2 93.98,104.14 93.98,99.06 A01.M2 | 90.17,97.16 88.9,95.89 v88.9,80.64 v88.9,61.59 88.9,23.5 90.81,21.59 90.81,19.68 B01.R2 | 90.17,97.16 90.81,97.79 90.81,100.97 A01.L2 | 90.17,97.16 v90.17,98.42 | v82.55,102.87 82.55,124.46 81.28,125.73 81.28,129.54 A02.A2
  Bottom 0.254: A08.A2 5.08,130.18 8.89,130.18 10.16,131.44 12.06,131.44 13.34,130.18 17.14,130.18 A07.A2 17.78,130.18 19.68,130.18 20.95,131.44 24.77,131.44 26.04,130.18 29.84,130.18 A06.A2 30.48,130.18 32.38,130.18 33.66,131.44 37.47,131.44 38.73,130.18 42.55,130.18 A05.A2 43.18,130.18 46.99,130.18 48.26,131.44 50.16,131.44 51.44,130.18 55.24,130.18 A04.A2 55.88,130.18 59.69,130.18 60.96,131.44 62.87,131.44 64.14,130.18 67.94,130.18 A03.A2 68.58,130.18 72.39,130.18 73.66,131.44 75.56,131.44 76.83,130.18 80.64,130.18 A02.A2 | B07.A2 17.78,60.33 21.59,60.33 22.86,61.59 24.77,61.59 26.04,60.33 29.84,60.33 B06.A2 30.48,60.33 32.38,60.33 33.66,61.59 37.47,61.59 38.73,60.33 42.55,60.33 B05.A2 43.18,60.33 46.99,60.33 48.26,61.59 50.16,61.59 51.44,60.33 55.24,60.33 B04.A2 55.88,60.33 57.78,60.33 59.05,61.59 62.87,61.59 64.14,60.33 67.94,60.33 B03.A2 68.58,60.33 72.39,60.33 73.66,61.59 75.56,61.59 76.83,60.33 80.64,60.33 B02.A2 81.28,60.96 81.92,61.59 v88.9,61.59 | v88.9,80.64 94.61,80.64 95.89,79.38 99.69,79.38 A01.U1 | v90.17,98.42 93.34,98.42 A01.M2 | v82.55,102.87 85.09,102.87 86.36,101.6 90.17,101.6 A01.L2
WRITE_DATA_L
  Top 0.254: B08.M1 11.43,29.21 15.88,29.21 15.88,62.23 12.7,65.41 12.7,92.71 9.53,95.89 9.53,120.02 21.59,132.08 85.72,132.08 85.72,128.91 92.08,122.56 92.08,119.38 90.81,118.11 90.81,114.94 A01.F2
WRITE_SELECT_L  (via drill 0.61)
  Top 0.254: v12.7,31.75 v12.7,48.9
  Bottom 0.254: v12.7,31.75 8.26,31.75 B08.L1 | v12.7,48.9 28.57,48.9 29.21,49.53 50.16,49.53 50.8,50.16 51.44,49.53 53.34,49.53 54.61,50.8 58.42,50.8 B04.D1
WT_CHK_L
  Bottom 0.254: B04.J1 59.05,37.47 60.33,36.2 99.06,36.2 99.69,35.56 B01.K1
WT_GATE_L  (via drill 0.61)
  Top 0.254: v69.85,33.02 69.85,76.83 71.12,78.11 v71.12,78.74
  Bottom 0.254: v69.85,33.02 85.09,33.02 86.36,31.75 90.17,31.75 B01.L2 | v71.12,78.74 71.75,78.11 83.82,78.11 87.63,81.92 88.9,81.92 89.53,81.28 91.44,81.28 96.52,86.36 96.52,87 95.25,88.27 94.61,88.27 93.98,87.63 68.58,87.63 64.77,91.44 63.5,91.44 62.87,90.81 46.35,90.81 43.81,93.34 41.27,93.34 40.64,93.98 38.73,93.98 38.1,94.61 38.1,97.79 38.73,97.79 44.45,103.5 44.45,106.05 46.35,106.05 47.62,107.31 47.62,109.22 42.55,114.3 40.01,114.3 A05.F2